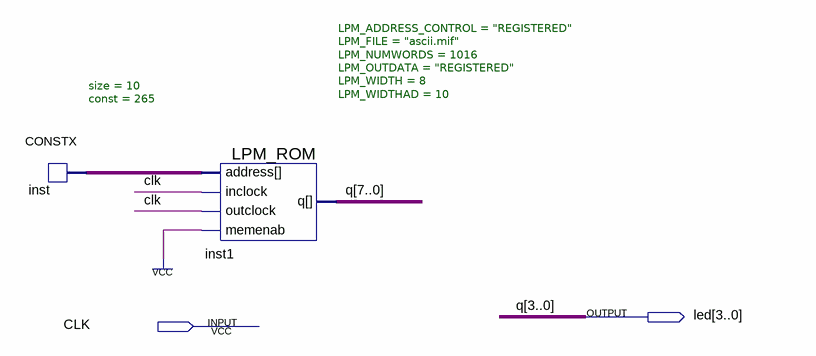
[diagram p0: schematic sheet]
// Quartus schematic mem_test.bdf as structural Verilog: 2 symbols, 2 pins
module mem_test (
  input  CLK,
  output [3:0] led
);

  wire [7:4] q;
  wire [9:0] inst_data;

  CONSTX #(.size(10), .\const (265)) inst (.data(inst_data));
  LPM_ROM #(.LPM_ADDRESS_CONTROL("REGISTERED"), .LPM_FILE("ascii.mif"), .LPM_NUMWORDS(1016), .LPM_OUTDATA("REGISTERED"), .LPM_WIDTH(8), .LPM_WIDTHAD(10)) inst1 (
    .address(inst_data), .inclock(CLK), .outclock(CLK), .memenab(1'b1), .q({q, led}));

  // Other names for the same wires on the sheet: q[3:0] = led
endmodule
